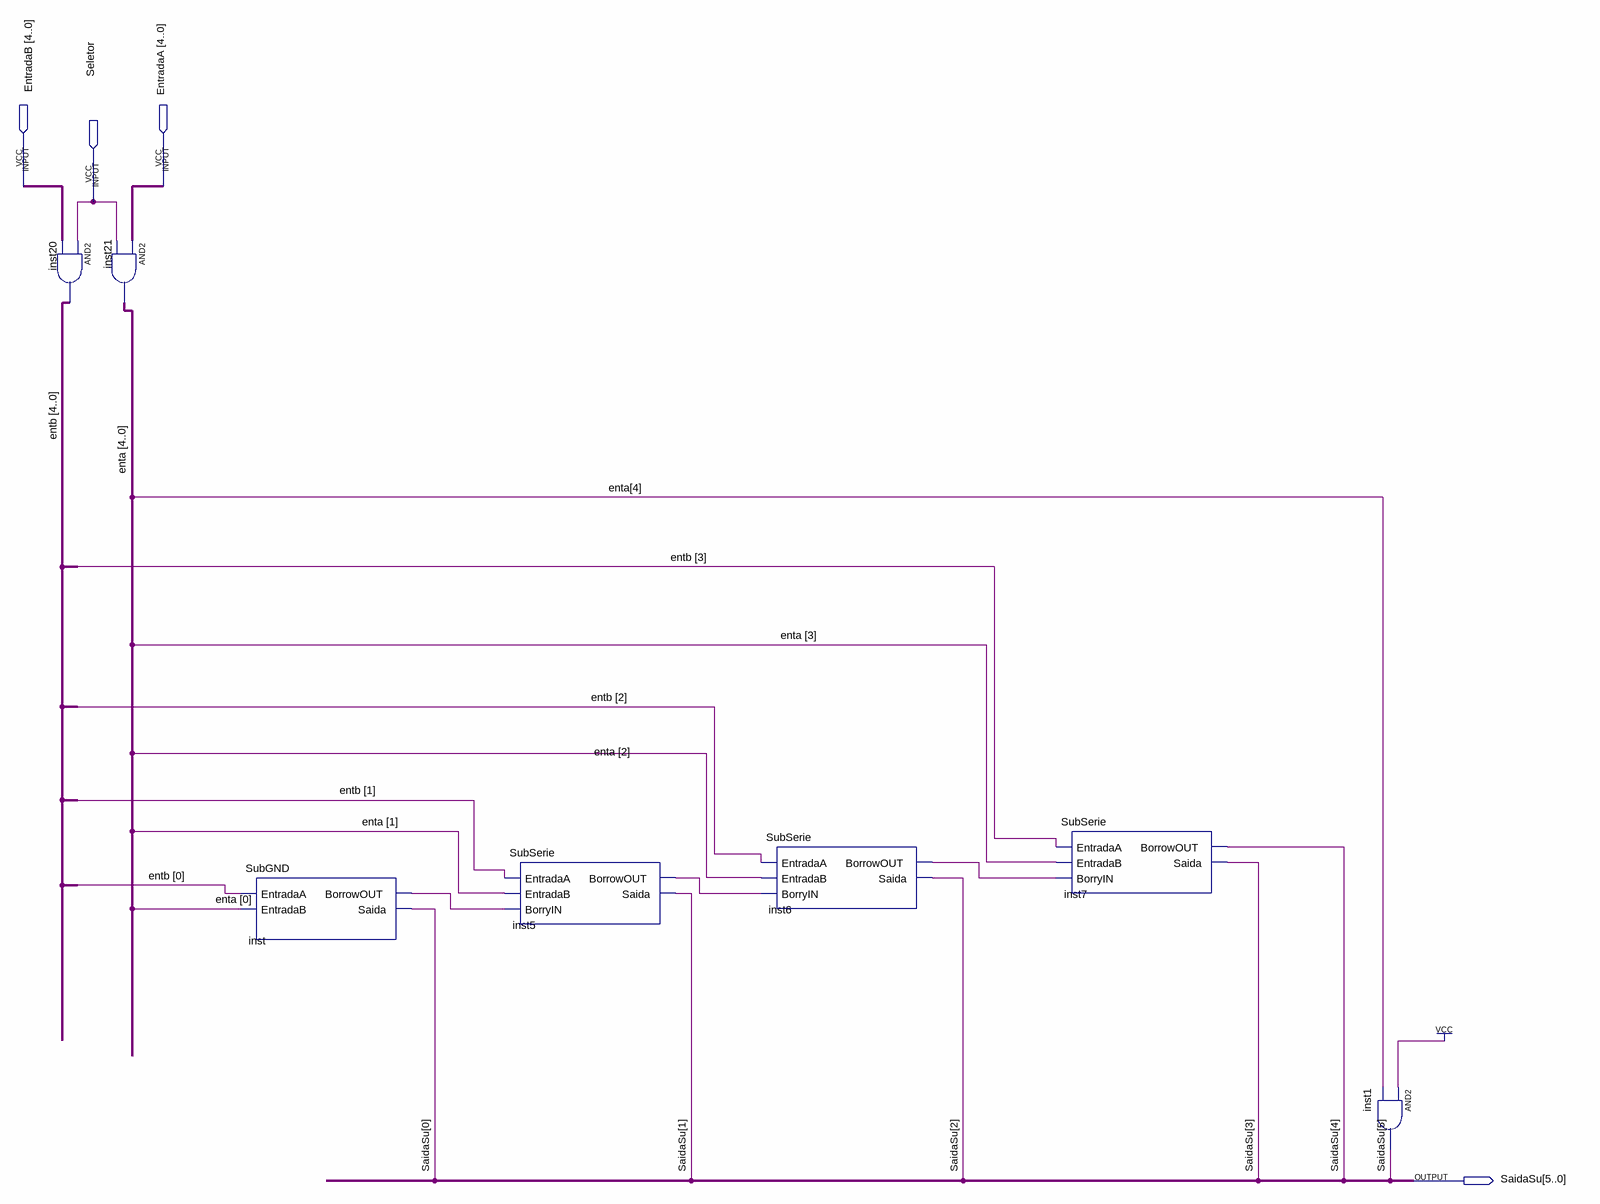
[diagram p0: schematic sheet]
// Quartus schematic Subtrator2.bdf as structural Verilog: 7 symbols, 4 pins
module Subtrator2 (
  input  [4:0] EntradaB,
  input  [4:0] EntradaA,
  input  Seletor,
  output [5:0] SaidaSu
);

  wire inst5_borrowout, inst6_borrowout, inst_borrowout;
  wire [4:0] enta, entb;

  assign entb = {5{Seletor}} & EntradaB;  // AND2 inst20, 5 bits wide
  assign enta = EntradaA & {5{Seletor}};  // AND2 inst21, 5 bits wide
  SubGND inst (.EntradaA(entb[0]), .EntradaB(enta[0]), .BorrowOUT(inst_borrowout), .Saida(SaidaSu[0]));
  SubSerie inst5 (
    .EntradaA(entb[1]), .EntradaB(enta[1]), .BorryIN(inst_borrowout), .BorrowOUT(inst5_borrowout),
    .Saida(SaidaSu[1]));
  SubSerie inst6 (
    .EntradaA(entb[2]), .EntradaB(enta[2]), .BorryIN(inst5_borrowout), .BorrowOUT(inst6_borrowout),
    .Saida(SaidaSu[2]));
  SubSerie inst7 (
    .EntradaA(entb[3]), .EntradaB(enta[3]), .BorryIN(inst6_borrowout), .BorrowOUT(SaidaSu[4]),
    .Saida(SaidaSu[3]));
  and inst1 (SaidaSu[5], 1'b1, enta[4]);
endmodule
